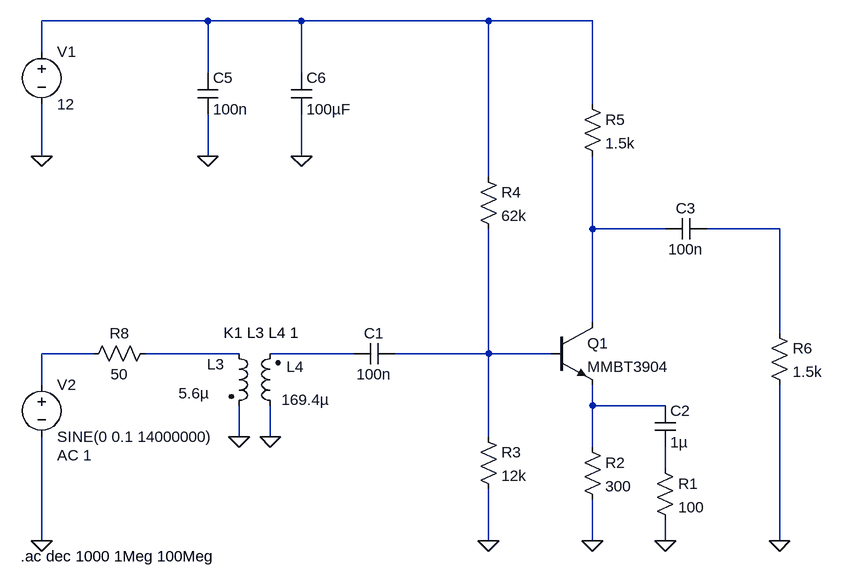
[diagram p0: schematic Antenna Amplifier.asc]
Antenna Amplifier.asc, the LTspice schematic file:
Version 4
SHEET 1 3796 680
WIRE -400 -352 -656 -352
WIRE -256 -352 -400 -352
WIRE 32 -352 -256 -352
WIRE 192 -352 32 -352
WIRE -656 -304 -656 -352
WIRE -400 -272 -400 -352
WIRE -256 -272 -256 -352
WIRE 192 -224 192 -352
WIRE -656 -144 -656 -224
WIRE -400 -144 -400 -208
WIRE -256 -144 -256 -208
WIRE 32 -112 32 -352
WIRE 192 -32 192 -144
WIRE 304 -32 192 -32
WIRE 480 -32 368 -32
WIRE 192 112 192 -32
WIRE 480 128 480 -32
WIRE -576 160 -656 160
WIRE -352 160 -496 160
WIRE -176 160 -304 160
WIRE 32 160 32 -32
WIRE 32 160 -112 160
WIRE 128 160 32 160
WIRE -656 208 -656 160
WIRE 192 240 192 208
WIRE 304 240 192 240
WIRE -352 288 -352 240
WIRE -304 288 -304 240
WIRE 32 288 32 160
WIRE 192 304 192 240
WIRE 304 336 304 304
WIRE -656 448 -656 288
WIRE 32 448 32 368
WIRE 192 448 192 384
WIRE 304 448 304 416
WIRE 480 448 480 208
FLAG -656 448 0
FLAG 304 448 0
FLAG 192 448 0
FLAG 32 448 0
FLAG -304 288 0
FLAG -656 -144 0
FLAG -400 -144 0
FLAG -256 -144 0
FLAG 480 448 0
FLAG -352 288 0
SYMBOL npn 128 112 R0
SYMATTR InstName Q1
SYMATTR Value MMBT3904
SYMBOL voltage -656 -320 R0
WINDOW 123 0 0 Left 2
WINDOW 39 0 0 Left 2
SYMATTR InstName V1
SYMATTR Value 12
SYMBOL voltage -656 192 R0
WINDOW 123 24 124 Left 2
WINDOW 39 0 0 Left 2
SYMATTR Value2 AC 1
SYMATTR InstName V2
SYMATTR Value SINE(0 0.1 14000000)
SYMBOL cap -112 144 R90
WINDOW 0 0 32 VBottom 2
WINDOW 3 32 32 VTop 2
SYMATTR InstName C1
SYMATTR Value 100n
SYMBOL cap 288 240 R0
SYMATTR InstName C2
SYMATTR Value 1µ
SYMBOL res 288 320 R0
SYMATTR InstName R1
SYMATTR Value 100
SYMBOL res 176 288 R0
SYMATTR InstName R2
SYMATTR Value 300
SYMBOL res 16 272 R0
SYMATTR InstName R3
SYMATTR Value 12k
SYMBOL res 16 -128 R0
SYMATTR InstName R4
SYMATTR Value 62k
SYMBOL ind2 -368 144 R0
WINDOW 0 -33 32 Left 2
WINDOW 3 -77 77 Left 2
SYMATTR InstName L3
SYMATTR Value 5.6µ
SYMATTR Type ind
SYMBOL ind2 -288 256 R180
WINDOW 0 -36 76 Left 2
WINDOW 3 -76 25 Left 2
SYMATTR InstName L4
SYMATTR Value 169.4µ
SYMATTR Type ind
SYMBOL cap 368 -48 R90
WINDOW 0 0 32 VBottom 2
WINDOW 3 32 32 VTop 2
SYMATTR InstName C3
SYMATTR Value 100n
SYMBOL cap -416 -272 R0
SYMATTR InstName C5
SYMATTR Value 100n
SYMBOL cap -272 -272 R0
SYMATTR InstName C6
SYMATTR Value 100µF
SYMBOL res -480 144 R90
WINDOW 0 0 56 VBottom 2
WINDOW 3 32 56 VTop 2
SYMATTR InstName R8
SYMATTR Value 50
SYMBOL res 176 -240 R0
SYMATTR InstName R5
SYMATTR Value 1.5k
SYMBOL res 464 112 R0
SYMATTR InstName R6
SYMATTR Value 1.5k
TEXT -376 128 Left 2 !K1 L3 L4 1
TEXT -688 472 Left 2 !.ac dec 1000 1Meg 100Meg

The netlist it stands for:
* Antenna Amplifier.asc
Q1 N002 N007 N008 0 MMBT3904
V1 N001 0 12
V2 N004 0 SINE(0 0.1 14000000) AC 1
C1 N007 N006 100n
C2 N008 N009 1µ
R1 N009 0 100
R2 N008 0 300
R3 N007 0 12k
R4 N001 N007 62k
L3 N005 0 5.6µ
L4 0 N006 169.4µ
C3 N003 N002 100n
C5 N001 0 100n
C6 N001 0 100µF
R8 N005 N004 50
R5 N001 N002 1.5k
R6 N003 0 1.5k
.model NPN NPN
.model PNP PNP
.lib standard.bjt
K1 L3 L4 1
.ac dec 1000 1Meg 100Meg
.backanno
.end